# Altium schematic sheet Expansion Board.SchDoc
size Letter
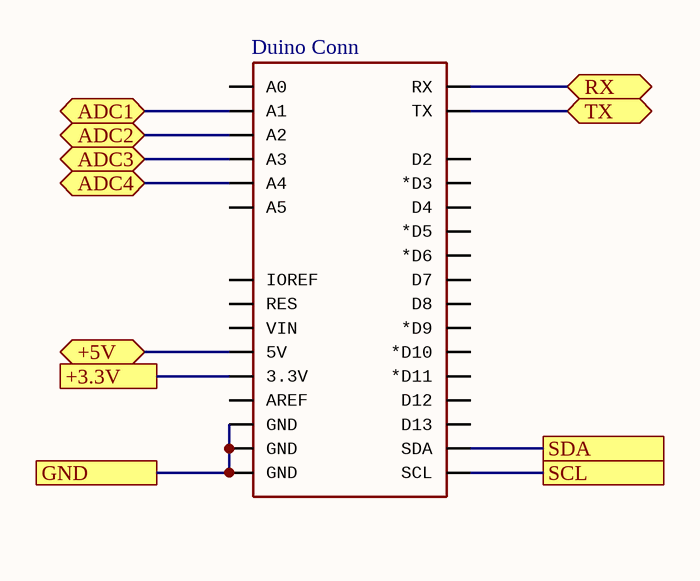
[diagram p0: Expansion Board.SchDoc]

## Parts
Duino_Conn  (no value)  [UNO_R3_SHIELD_NOLABELS]

## Ports
+3.3V, +5V, ADC1, ADC2, ADC3, ADC4, GND, RX, SCL, SDA, TX

## Nets
+3.3V: Duino_Conn.3.3V ; port +3.3V
+5V: Duino_Conn.5V ; port +5V
ADC1: Duino_Conn.A1 ; port ADC1
ADC2: Duino_Conn.A2 ; port ADC2
ADC3: Duino_Conn.A3 ; port ADC3
ADC4: Duino_Conn.A4 ; port ADC4
GND: Duino_Conn.GND@0(GND) Duino_Conn.GND@1(GND) Duino_Conn.GND@2(GND) ; port GND
RX: Duino_Conn.RX ; port RX
SCL: Duino_Conn.SCL ; port SCL
SDA: Duino_Conn.SDA ; port SDA
TX: Duino_Conn.TX ; port TX

Not connected (* = marked no-connect by the designer): Duino_Conn A0 A5 AREF D2 D3(*D3) D4 D5(*D5) D6(*D6) D7 D8 D9(*D9) D10(*D10) D11(*D11) D12 D13 IOREF RES VIN

## Library data of the parts
Duino_Conn = ARDUINO_R3_SHIELDNOLABELS